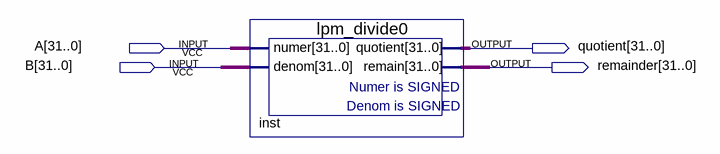
[diagram p0: schematic sheet]
// Quartus schematic testeDiv.bdf as structural Verilog: 1 symbols, 4 pins
module testeDiv (
  input  [31:0] A,
  input  [31:0] B,
  output [31:0] quotient,
  output [31:0] remainder
);

  lpm_divide0 inst (.numer(A), .denom(B), .quotient(quotient), .remain(remainder));
endmodule
